# EAGLE design USB_to_TTL (EAGLE 9.6.2)
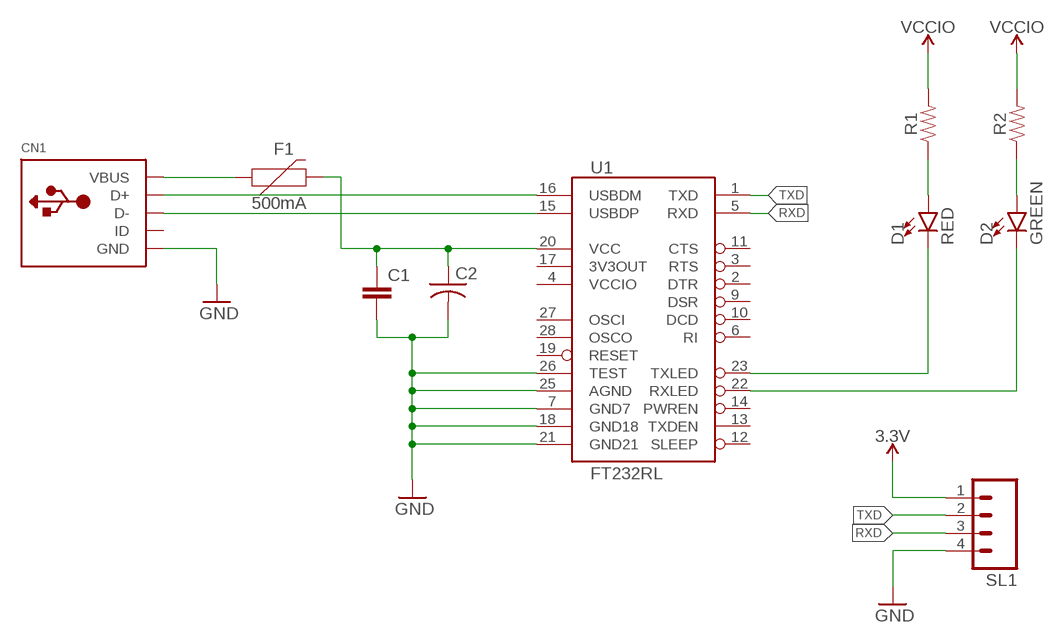
[diagram p0: schematic, sheet 1]

## Parts
C1  C-EUC1206  [C1206]
C2  C-USC1206  [C1206]
CN1  USBMINIB  [USB-MINIB]
D1  RED  LED-RED1206  [LED-1206]
D2  GREEN  LED-GREEN1206  [LED-1206]
F1  500mA  PPTC_HALF-AMP  [1206]
R1  RESISTOR1206  [1206]
R2  RESISTOR1206  [1206]
SL1  M04  [04P]
U1  FT232RL  FT232RLSSOP  [SSOP28DB]

## Nets
3.3V: SL1.1
GND: C1.2 C2.2 CN1.GND SL1.4 U1.7(GND7) U1.18(GND18) U1.21(GND21) U1.25(AGND) U1.26(TEST)
N$1: CN1.VBUS F1.1
N$2: C1.1 C2.1 F1.2 U1.20(VCC)
N$3: CN1.D+ U1.16(USBDM)
N$4: CN1.D- U1.15(USBDP)
N$5: D1.C U1.23(TXLED)
N$6: D2.C U1.22(RXLED)
N$7: D1.A R1.1
N$8: D2.A R2.1
RXD: SL1.3 U1.5(RXD)
TXD: SL1.2 U1.1(TXD)
VCCIO: R1.2 R2.2
Unconnected: CN1.ID U1.2(DTR) U1.3(RTS) U1.6(RI) U1.9(DSR) U1.10(DCD) U1.11(CTS) U1.12(SLEEP) U1.13(TXDEN) U1.14(PWREN) U1.17(3V3OUT) U1.19(RESET) U1.27(OSCI) U1.28(OSCO)

## Power pins joined to a net without a drawn wire
VCCIO: U1.4(VCCIO)

## Library data of the parts
C1 = rcl:C-EU: CAPACITOR, European symbol; SPICEPREFIX: C
C2 = adafruit:C-US: CAPACITOR, American symbol
CN1 = adafruit:USB: USB Connectors USBMINIB - Surface Mount Female Mini-B USB Connector 4UConnector: 06564 By microbuilder.eu Thru-hole RA Female Mini-B USB Connector 4UConnector: 18732 By ladyada.net
D1 = SparkFun-LED:LED-RED: Red SMD LED Used in manufacturing of most products at SparkFun Packages: 0603 - SMD 0603 package [Product Link] <http://docs.avagotech.com/docs/AV02-0551EN> 0603 SMART - SMD 0603 SMART package ( more efficient and expensive)[Product Link] <http://www.osram-os.com/Graphics/XPic2/00077099_0.pdf> 1206 - SMD1206 package [Product Link] <https://www.sparkfun.com/datasheets/DevTools/LilyPad/Q150OVS4.pdff> SparkFun Products: Pro Mini 328 -5V <https://www.sparkfun.com/products/821> RedBoard <https://www.sparkfun.com/products/12757> IOIO-OTG <https://www.sparkfun.com/products/13613>; PROD_ID: DIO-09912
D2 = SparkFun-LED:LED-GREEN: Green SMD LED Used in manufacturing of various products at SparkFun Packages: 0603 - SMD 0603 package [Product Link] <http://www.futureelectronics.com/en/technologies/semiconductors/optoelectronics/leds/Pages/9894312-LTST-C190GKT.aspx?CrossPart=HSMG-C190&IM=0> LilyPad 1206 - SMD1206 LilyPad package [Product Link] <http://www.futureelectronics.com/en/Technologies/Product.aspx?ProductID=IN150NGHARVATEKCORPORATION2049943&IM=0> 1206 - SMD1206 package [Product Link] <http://www.futureelectronics.com/en/technologies/semiconductors/optoelectronics/leds/Pages/8315665-LTST-C150KGKT.aspx?IM=0> 1206 Bottom Mount -SMD 1206 Bottom Mount [Product Link] <http://www.digikey.com/product-detail/en/lite-on-inc/LTST-C230KGKT/160-1456-1-ND/386854> SparkFun Products: Pro Mini 328 -5V <https://www.sparkfun.com/products/821> RedBoard <https://www.sparkfun.com/products/12757> MP3 Trigger <https://www.sparkfun.com/products/13720> Makey Makey <https://www.sparkfun.com/products/11076>; PROD_ID: DIO-00862
F1 = SparkFun-Fuses:PPTC: Resettable Fuse PPTC Resettable Fuse. Really a sort of resistor with a polymeric positive temperature coefficient whose resistance increases dramatically with an increase in temperature. When heated by the power passing through the resistance rises causing the current to be limited, protecting the circuit. This is achieved by the transition of the polymer from a crystalline to an amorphous state where the conductive carbon separates breaking the conductive pathways found in the cool crystalline structure. When a PPTC cools back down it resumes conducting letting the circuit turn back on. SparkFun Products: SparkFun RedBoard - Programmed with Arduino <https://www.sparkfun.com/products/12757> Pro Micro - 5V/16MHz <https://www.sparkfun.com/products/12640> Arduino Pro 328 - 5V/16MHz <https://www.sparkfun.com/products/10915> MP3 Trigger <https://www.sparkfun.com/products/13720>; PROD_ID: RES-08585; VALUE: 6V/0.5A
R1 R2 = SparkFun-Resistors:RESISTOR: Generic Resistor Package
SL1 = con-amp-quick:M04: AMP QUICK CONNECTOR; OC_FARNELL: unknown; OC_NEWARK: unknown
U1 = SparkFun-IC-Comms:FT232RL: FT232RL USB UART FT232RL 4th Generation USB UART (USB <-> Serial) Controller. Datasheet <http://www.sparkfun.com/datasheets/IC/FT232R_v104.pdf> SparkFun Products Component <https://www.sparkfun.com/products/650> (COM-00650) SparkFun RedBot Mainboard <https://www.sparkfun.com/products/12097> (ROB-12097) SparkFun FTDI Basic Breakout - 5V <https://www.sparkfun.com/products/9716> (DEV-09716) SparkFun FTDI Basic Breakout - 3.3V <https://www.sparkfun.com/products/9873> (DEV-09873) Bus Pirate - v3.6a <https://www.sparkfun.com/products/12942> (TOL-12942) SparkFun USB to Serial Breakout - FT232RL <https://www.sparkfun.com/products/12731> (BOB-12731) SparkFun PicoBoard <https://www.sparkfun.com/products/11888> (WIG-11888) SparkFun RFID USB Reader <https://www.sparkfun.com/products/9963> (SEN-09963) LilyPad FTDI Basic Breakout - 5V <https://www.sparkfun.com/products/10275> (DEV-10275) SparkFun Stepoko <https://www.sparkfun.com/products/13899> (ROB-13899); PROD_ID: IC-00870

## Board
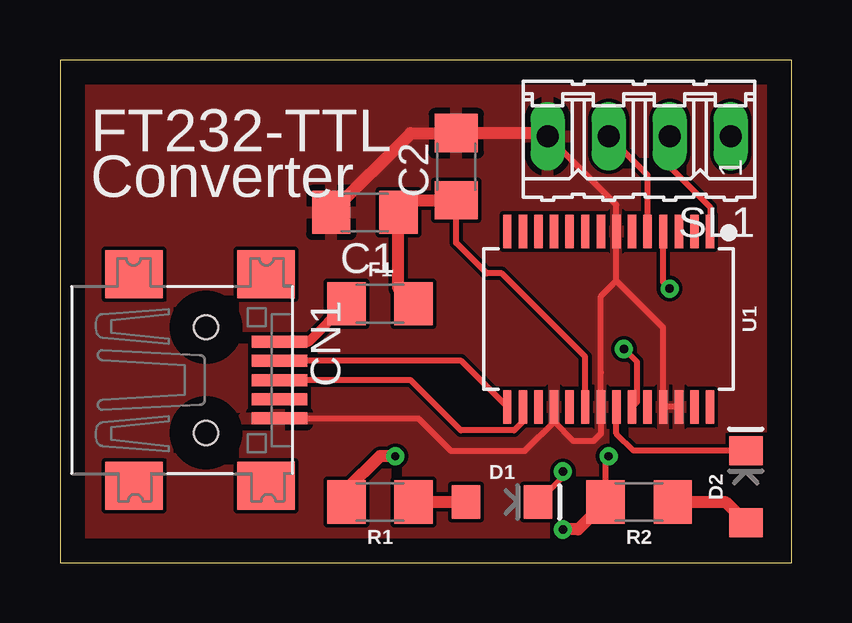
[diagram p1: board, top side]
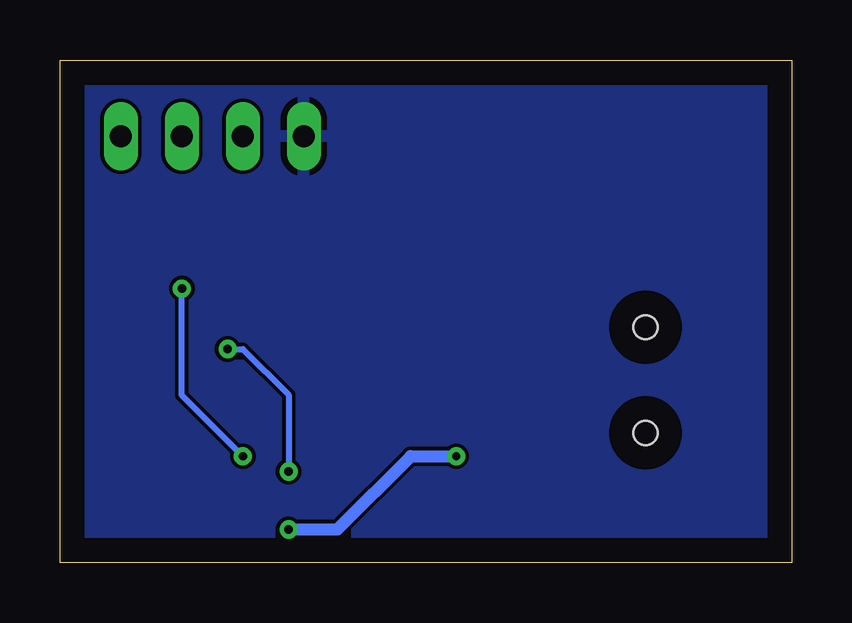
[diagram p2: board, bottom side, seen from below]

Size 30.48 x 20.95 mm. Coordinates in mm from the lower left corner, seen from the top.
Outline: 0,0 30.48,0 30.48,20.95 0,20.95 0,0
Copper layers (1*16): Top 0.035mm / dielectric 1.5mm / Bottom 0.035mm
Design rules "default": minimum track width 6mil, minimum drill 0.35mm, track to track 6mil, track to pad 6mil, pad to pad 6mil, via to via 6mil, smd to smd 6mil, copper to edge 40mil, drill to drill 6mil, minimum pad ring 10mil, minimum via ring 8mil, stop-mask expansion 4mil, vias tented up to drill 0mil, thermal gap 10mil

### Footprints (pad centres in the part's own frame; a part is rotated, then mirrored left to right if it is on the bottom)
C1206 = smd 1.6 x 1.8: 1 -1.4,0; 2 1.4,0
USB-MINIB = smd 0.5 x 2.308: D+ 0,4.064; D- -0.8,4.064; GND 1.6,4.064; ID 0.8,4.064; VBUS -1.6,4.064 | smd 2 x 2.4: GND1 -4.4,-2; GND2 -4.4,3.5; GND3 4.4,3.5; GND4 4.4,-2 | hole 1: -2.2,1; 2.2,1
LED-1206 = smd 1.2 x 1.4: A -1.5,0; C 1.5,0
1206 = smd 1.6 x 1.8: 1 -1.4,0; 2 1.4,0
04P = drill 0.914 long: 1 -3.81,0; 2 -1.27,0; 3 1.27,0; 4 3.81,0
SSOP28DB = smd 0.348 x 1.397: 1 -4.225,-3.656; 2 -3.575,-3.656; 3 -2.925,-3.656; 4 -2.275,-3.656; 5 -1.625,-3.656; 6 -0.975,-3.656; 7 -0.325,-3.656; 8 0.325,-3.656; 9 0.975,-3.656; 10 1.625,-3.656; 11 2.275,-3.656; 12 2.925,-3.656; 13 3.575,-3.656; 14 4.225,-3.656; 15 4.225,3.656; 16 3.575,3.656; 17 2.925,3.656; 18 2.275,3.656; 19 1.625,3.656; 20 0.975,3.656; 21 0.325,3.656; 22 -0.325,3.656; 23 -0.975,3.656; 24 -1.625,3.656; 25 -2.275,3.656; 26 -2.925,3.656; 27 -3.575,3.656; 28 -4.225,3.656

### Placement (x,y rotation side)
C1  12.7,14.61 180 top
C2  16.51,16.51 90 top
CN1  5.08,7.62 270 top
D1  18.41,2.54 0 top
D2  28.57,3.17 90 top
F1  13.34,10.79 0 top
R1  13.34,2.54 180 top
R2  24.13,2.54 180 top
SL1  24.13,17.78 180 top
U1  22.86,10.16 180 top

### Tracks (layer width: path | path; a pad name or v marks a point on that pad's centre or on a via)
GND
  Top 0.254: SL1.4 23.18,14.91 U1.7 23.18,11.76 | U1.21 22.54,11.11 23.18,11.76 | CN1.GND 14.94,6.02 16.28,4.67 19.37,4.67 20.59,5.89 | U1.21 22.54,7.93 | U1.26 U1.25 25.14,9.8 23.18,11.76 | U1.21 22.54,5.39 22.23,5.08 21.39,5.08 20.59,5.89 | 20.59,5.89 U1.18
  Top 0.508: SL1.4 20.19,17.91 C2.2 14.61,17.91 C1.2
  pour Top: 0,0 0,20.95 30.48,20.95 30.48,0
  pour Bottom: 0,0 0,20.95 30.48,20.95 30.48,0
N$1
  Top 0.406: CN1.VBUS 10.36,9.22 F1.1
N$2
  Top 0.254: U1.20 21.89,8.6 18.41,12.06 17.78,12.06 16.51,13.34 C2.1
  Top 0.508: F1.2 14.1,11.43 C1.1 14.61,15.11 C2.1
N$3
  Top 0.254: CN1.D+ 14.61,7.62 16.7,5.53 18.93,5.53 19.29,5.89 U1.16
N$4
  Top 0.254: U1.15 16.72,8.42 CN1.D-
N$5  (via drill 0.35)
  Top 0.254: D1.C 20.95,3.58 v20.95,3.81 | v23.5,8.91 24.03,8.38 24.03,6.7 U1.23
  Bottom 0.254: v23.5,8.91 22.86,8.91 20.95,7.01 v20.95,3.81
N$6
  Top 0.254: D2.C 23.9,4.67 23.18,5.39 U1.22
N$7
  Top 0.508: R1.1 D1.A
N$8
  Top 0.508: R2.1 27.71,2.54 D2.A
RXD
  Top 0.254: U1.5 24.48,16.16 SL1.3
TXD
  Top 0.254: SL1.2 25.4,16.51 27.09,14.82 U1.1
VCCIO  (via drill 0.35)
  Top 0.254: R2.2 22.73,4.32 v22.86,4.45 | v25.4,11.43 25.14,11.7 U1.4
  Top 0.508: R2.2 21.58,1.39 v20.95,1.39 | R1.2 11.94,3.04 13.34,4.45 v13.97,4.45
  Bottom 0.254: v22.86,4.45 25.4,6.99 v25.4,11.43
  Bottom 0.508: v20.95,1.39 18.93,1.39 15.88,4.45 v13.97,4.45

### Text on the board
tPlace: FT232-TTL | Converter